# Altium schematic sheet FTDIChip.SchDoc
size A
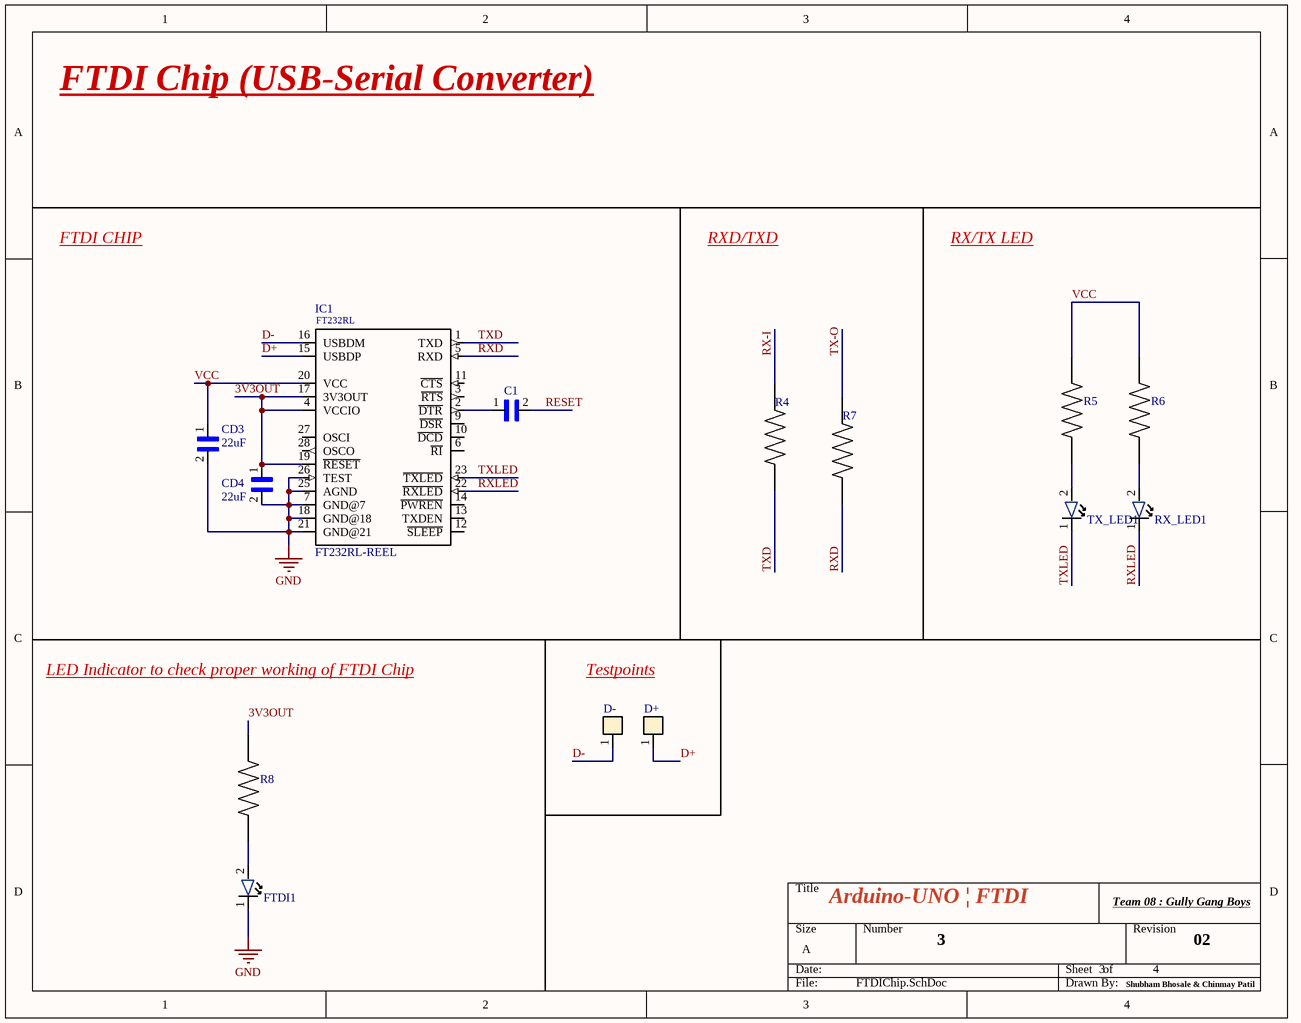
[diagram p0: FTDIChip.SchDoc]

## Parts
C1  CL31A226MOCLNNC  [1206_Passive]  (value not drawn)
CD3  22uF  [1206_Passive]
CD4  22uF  [1206_Passive]
D+  TESTPOINT  [TestPoint]  (value not drawn)
D-  TESTPOINT  [TestPoint]  (value not drawn)
FTDI1  LTST-C150CKT  [LED]  (value not drawn)
IC1  FT232RL-REEL  [FTDI]
R4  RNCP1206FTD1K00  [1206_Passive]  (value not drawn)
R5  RNCP1206FTD1K00  [1206_Passive]  (value not drawn)
R6  RNCP1206FTD1K00  [1206_Passive]  (value not drawn)
R7  RNCP1206FTD1K00  [1206_Passive]  (value not drawn)
R8  RNCP1206FTD1K00  [1206_Passive]  (value not drawn)
RX_LED1  LTST-C150CKT  [LED]  (value not drawn)
TX_LED1  LTST-C150CKT  [LED]  (value not drawn)

## Nets
GND: CD3.2 CD4.2 FTDI1.1 IC1.7(GND@7) IC1.18(GND@18) IC1.21(GND@21) IC1.25(AGND) IC1.26(TEST)
3V3OUT: CD4.1 IC1.4(VCCIO) IC1.17(3V3OUT) IC1.19(~{RESET}) R8.1
D+: D+.1 IC1.15(USBDP)
D-: D-.1 IC1.16(USBDM)
RESET: C1.2
RX-I: R4.2
RXD: IC1.5(RXD) R7.1
RXLED: IC1.22(~{RXLED}) RX_LED1.1
TX-O: R7.2
TXD: IC1.1(TXD) R4.1
TXLED: IC1.23(~{TXLED}) TX_LED1.1
VCC: CD3.1 IC1.20(VCC) R5.1 R6.1
NetC1_1: C1.1 IC1.2(~{DTR})
NetFTDI1_2: FTDI1.2 R8.2
NetR5_2: R5.2 TX_LED1.2
NetR6_2: R6.2 RX_LED1.2

Not connected (* = marked no-connect by the designer): IC1 3(~{RTS}) 6(~{RI}) 9(~{DSR}) 10(~{DCD}) 11(~{CTS}) 12(~{SLEEP}) 13(TXDEN) 14(~{PWREN}) 27(OSCI) 28(OSCO)

## Notes on the sheet
- FTDI Chip (USB-Serial Converter)
- FTDI CHIP
- RXD/TXD
- RX/TX LED
- LED Indicator to check proper working of FTDI Chip
- Testpoints
- Arduino-UNO | FTDI
- Team 08 : Gully Gang Boys
- 3
- 4
- 02
- Shubham Bhosale & Chinmay Patil
- (in symbol FTDI) FT232RL

## Library data of the parts
C1 CD3 CD4 = 1206_22uF: 22µF ±20% 16V Ceramic Capacitor X5R 1206 (3216 Metric); Value: CAP CER 22UF 16V X5R 1206; Digikey Link: https://www.digikey.com/product-detail/en/CL31A226MOCLNNC/1276-2728-1-ND/3890814/?itemSeq=304982363; Digikey Part: 1276-2728-1-ND
FTDI1 RX_LED1 TX_LED1 = 1206_RED_LED: Red 638nm LED Indication - Discrete 1.8V 1206 (3216 Metric); Value: LED RED CLEAR 1206 SMD; Digikey Link: https://www.digikey.com/product-detail/en/LTST-C150CKT/160-1167-1-ND/269239/?itemSeq=304982368; Digikey Part: 160-1167-1-ND
IC1 = FTDI: USB Bridge, USB to UART USB 2.0 UART Interface 28-SSOP; Value: IC USB FS SERIAL UART 28-SSOP; Digikey Part: 768-1007-1-ND; Digikey Link: https://www.digikey.com/product-detail/en/FT232RL-REEL/768-1007-1-ND/1836402/?itemSeq=304982359
R4-R8 = 1206_1K: 1 kOhms ±1% 0.5W, 1/2W Chip Resistor 1206 (3216 Metric) Anti-Sulfur, Moisture Resistant Thin Film; Value: RES 1K OHM 1% 1/2W 1206; Digikey Link: https://www.digikey.com/product-detail/en/RNCP1206FTD1K00/RNCP1206FTD1K00CT-ND/2240675/?itemSeq=304982373; Digikey Part: RNCP1206FTD1K00CT-ND